# Altium schematic sheet 01-PWR.SchDoc
size A4; SheetNumber: 2; SheetTotal: 4
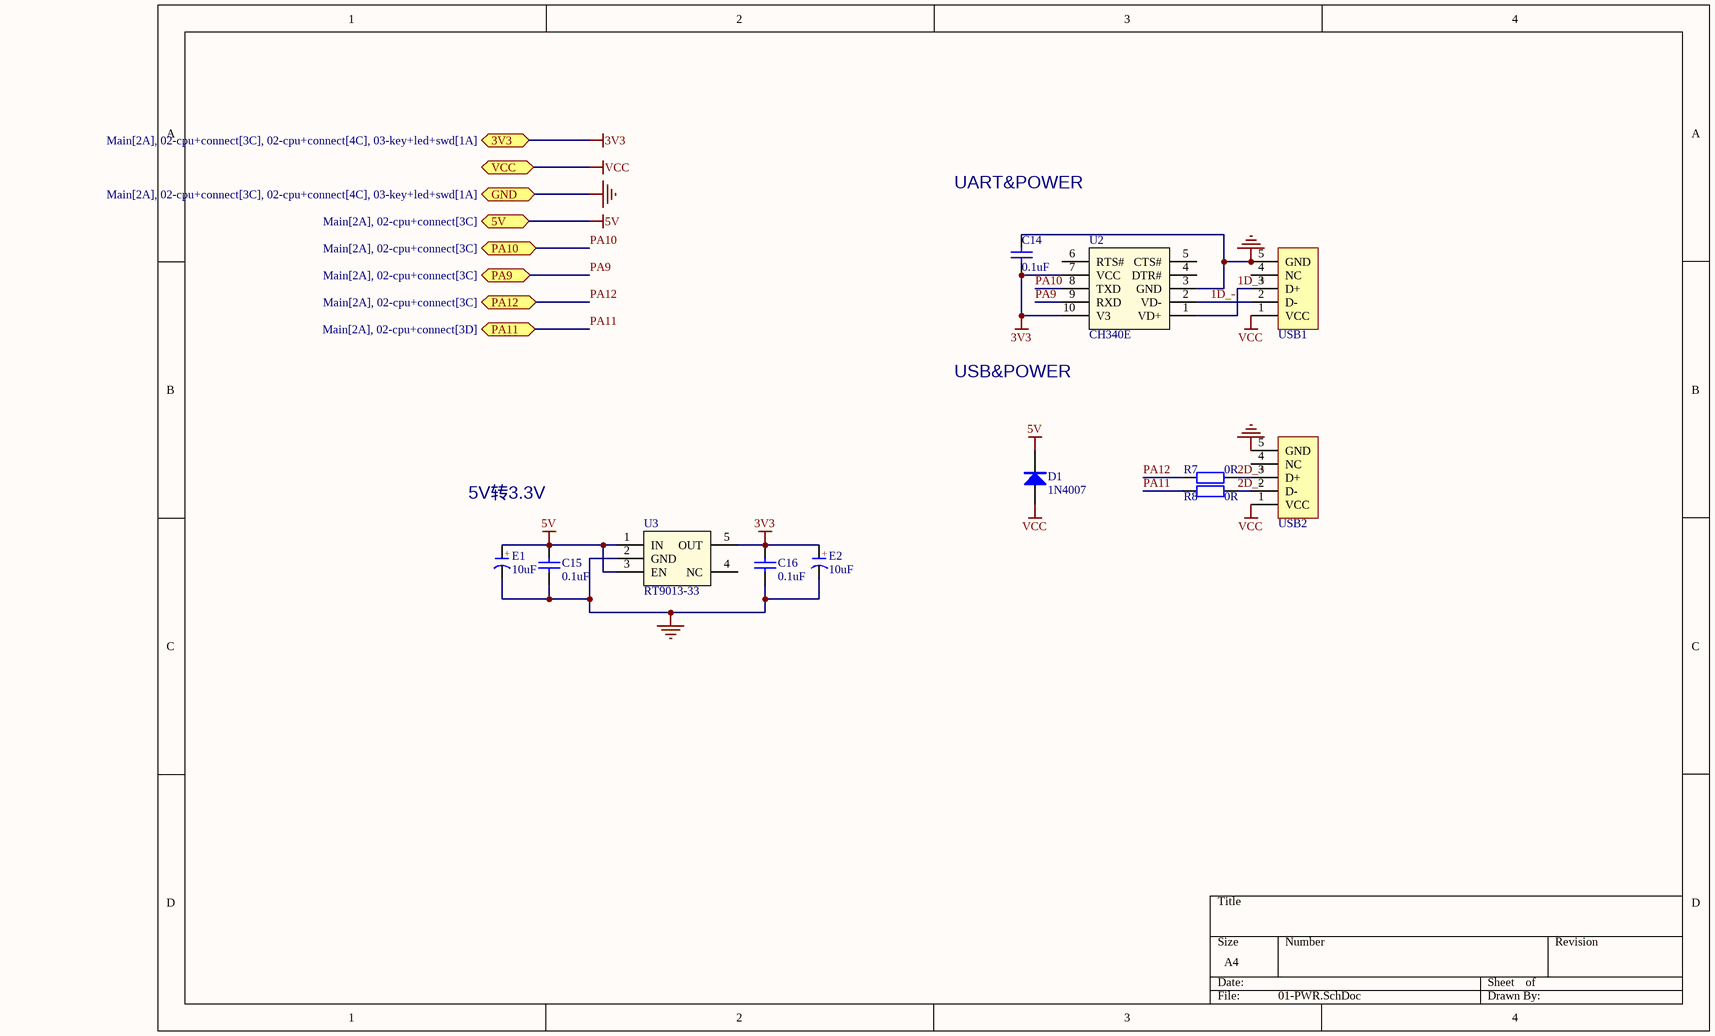
[diagram p0: 01-PWR.SchDoc]

## Parts
C14  0.1uF  [C 0402_L]
C15  0.1uF  [C 0402_L]
C16  0.1uF  [C 0402_L]
D1  1N4007  [SOD-123]
E1  10uF  [CD A(3216)]
E2  10uF  [CD A(3216)]
R7  0R  [R 0402_L]
R8  0R  [R 0402_L]
U2  CH340E  [MSOP10_L]
U3  RT9013-33  [SOT23-5N]
USB1  USB  [USB-MICRO_E]  (value not drawn)
USB2  USB  [USB-MICRO_E]  (value not drawn)

## Ports
3V3 (bidir, see Main[2A], 02-cpu+connect[3C], 02-cpu+connect[4C], 03-key+led+swd[1A]), 5V (bidir, see Main[2A], 02-cpu+connect[3C]), GND (bidir, see Main[2A], 02-cpu+connect[3C], 02-cpu+connect[4C], 03-key+led+swd[1A]), PA9 (bidir, see Main[2A], 02-cpu+connect[3C]), PA10 (bidir, see Main[2A], 02-cpu+connect[3C]), PA11 (bidir, see Main[2A], 02-cpu+connect[3D]), PA12 (bidir, see Main[2A], 02-cpu+connect[3C]), VCC (bidir)

## Nets
3V3: C14.2 C16.2 E2.1(A) U2.7(VCC) U2.10(V3) U3.5(OUT) ; port 3V3
5V: C15.2 D1.2(K) E1.1(A) U3.1(IN) U3.3(EN) ; port 5V
GND: C14.1 C15.1 C16.1 E1.2(K) E2.2(K) U2.3(GND) U3.2(GND) USB1.5(GND) USB2.5(GND) ; port GND
VCC: D1.1(A) USB1.1(VCC) USB2.1(VCC) ; port VCC
1D_+: U2.1(VD+) USB1.3(D+)
1D_-: U2.2(VD-) USB1.2(D-)
2D_+: R7.1 USB2.3(D+)
2D_-: R8.1 USB2.2(D-)
PA9: U2.9(RXD) ; port PA9
PA10: U2.8(TXD) ; port PA10
PA11: R8.2 ; port PA11
PA12: R7.2 ; port PA12

Not connected (* = marked no-connect by the designer): U2 4(DTR#) 5(CTS#) 6(RTS#); U3 4(NC); USB1 4(NC); USB2 4(NC)

## Notes on the sheet
- UART&POWER
- USB&POWER
- 5V转3.3V
- (in symbol C-CD) +

## Library data of the parts
C14-C16 = Cap
D1 = 1N4007: 整流二极管; BOM名称: 整流二极管
E1 E2 = C-CD: 贴片钽电容; BOM名称: 贴片钽电容
R7 R8 = Res